# Altium schematic sheet DAC_Analog_Output.SchDoc
size A4
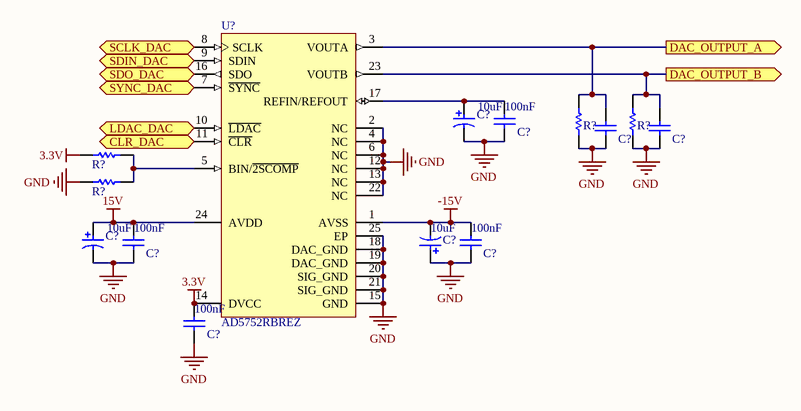
[diagram p0: DAC_Analog_Output.SchDoc]

## Parts
(Parts that share a designator on the sheet are numbered #1, #2 ... from top to bottom, then left to right.)
C?#1  Capacitance: 10uF  [KEMT-A-3216-18-2_M]  (hidden comment: T491A106K016AT)
C?#2  value 100nF  [CAPC0402(1005)60_L]  (hidden comment: CAP0402)
C?#3  CAP0402  [CAPC0402(1005)60_L]  (value not drawn)
C?#4  CAP0402  [CAPC0402(1005)60_L]  (value not drawn)
C?#5  Capacitance: 10uF  [KEMT-A-3216-18-2_M]  (hidden comment: T491A106K016AT)
C?#6  value 100nF  [CAPC0402(1005)60_L]  (hidden comment: CAP0402)
C?#7  value 100nF  [CAPC0402(1005)60_L]  (hidden comment: CAP0402)
C?#8  Capacitance: 10uF  [KEMT-A-3216-18-2_M]  (hidden comment: T491A106K016AT)
C?#9  value 100nF  [CAPC0402(1005)60_L]  (hidden comment: CAP0402)
R?#1  RES0402  [RESC0402(1005)_L]  (value not drawn)
R?#2  RES0402  [RESC0402(1005)_L]  (value not drawn)
R?#3  RES0402  [RESC0402(1005)_L]  (value not drawn)
R?#4  RES0402  [RESC0402(1005)_L]  (value not drawn)
U?  AD5752RBREZ  [RE-24_L]

## Ports
CLR_DAC (in), DAC_OUTPUT_A (out), DAC_OUTPUT_B (out), LDAC_DAC (in), SCLK_DAC (in), SDIN_DAC (in), SDO_DAC (out), SYNC_DAC (in)

## Nets
3.3V: C?#9.1 R?#3.2 U?.14(DVCC)
15V: C?#5.1 C?#6.1 U?.24(AVDD)
-15V: C?#7.1 C?#8.2 U?.1(AVSS)
GND: C?#1.2 C?#2.2 C?#3.2 C?#4.2 C?#5.2 C?#6.2 C?#7.2 C?#8.1 C?#9.2 R?#1.2 R?#2.2 R?#4.2 U?.2(NC) U?.4(NC) U?.6(NC) U?.12(NC) U?.13(NC) U?.15(GND) U?.18(DAC_GND) U?.19(DAC_GND) U?.20(SIG_GND) U?.21(SIG_GND) U?.22(NC) U?.25(EP)
CLR_DAC: U?.11(~{CLR}) ; port CLR_DAC
DAC_OUTPUT_A: C?#3.1 R?#1.1 U?.3(VOUTA) ; port DAC_OUTPUT_A
DAC_OUTPUT_B: C?#4.1 R?#2.1 U?.23(VOUTB) ; port DAC_OUTPUT_B
LDAC_DAC: U?.10(~{LDAC}) ; port LDAC_DAC
SCLK_DAC: U?.8(SCLK) ; port SCLK_DAC
SDIN_DAC: U?.9(SDIN) ; port SDIN_DAC
SDO_DAC: U?.16(SDO) ; port SDO_DAC
SYNC_DAC: U?.7(~{SYNC}) ; port SYNC_DAC
NetC?#1_1: C?#1.1 C?#2.1 U?.17(REFIN/REFOUT)
NetR?#3_1: R?#3.1 R?#4.1 U?.5(BIN/~{2SCOMP})

## Library data of the parts
C?#1 C?#5 C?#8 = CMP-2000-05173-1: Capacitor, Tantalum, 10 uF, +/- 10%, 16 V, -55 to 125 degC, 2-Pin SMD (1206), RoHS, Tape and Reel; Manufacturer: Kemet; Insulation: NotRequired; Voltage: 16VDC; Product Height (mm): 1.6mm; Polarity: Polar; Lead Spacing (nom): NotRequiredmm; Product Length (mm): 3.2mm; Case Style: Molded; DCL: 1.6uA; ESR: 7ohm; DF: 8%; Mounting Style: SurfaceMount; Manufacturer URL: http://www.kemet.com/; Datasheet Version: Apr-14; Package Description: 2-Pin Surface Mount Device, Body 3.2 x 1.6 mm; Operating Temp Range: -55Cto125C; Package Reference: 1206; Wire Form: NotRequired; Datasheet URL: http://www.farnell.com/datasheets/1824869.pdf; Tolerance (+ or -): 10%; Failure Rate: NotRequired; Length W/Weld: NotRequiredmm; Package / Case: 3216-18; Seated Plane Height: NotRequiredmm; Product Diameter (mm): NotRequiredmm; Construction: SMTChip; Seal: NotRequired; Case Code: A; Product Depth (mm): 1.6mm; Packaging: TapeandReel
C?#2 C?#6 C?#7 C?#9 = CMP-1590-00004-1: 0402 (1005 Metric) Chip Capacitor; Case-EIA: 0402; Case-Metric: 1005; PackageReference: CAPC0402(1005)60
C?#3 C?#4 = CMP-1590-00004-1: 0402 (1005 Metric) Chip Capacitor; Case-EIA: 0402; Value: 100nF; Case-Metric: 1005; PackageReference: CAPC0402(1005)60
R?#1-R?#4 = CMP-1591-00004-1: 0402 (1005 Metric) Chip Resistor; Case-EIA: 0402; Case-Metric: 1005; PackageReference: RESC0402(1005)
U? = CMP-0318-01754-2: Dual 16-Bit Voltage Output Digital-to-Analog Converter with Serial Interface, -40 to +85 degC, RE-24, Pb-Free, Tube; Manufacturer: Analog Devices; Max V+: 16.5V; Settling Time: 7.5Âµs; # DAC Outputs: 2; Single Supply: Yes; Op Pwr Diss: 190mW; Resolution (Bits): 16; PartNumber: AD5752RBREZ; ComponentLink1URL: http://www.analog.com/en/index.html; ComponentLink3URL: http://www.analog.com/static/imported-files/packages/PKG_PDF/TSSOP_EP(RE)/RE_24.pdf; Generic Part Number: AD5752R; RoHS: Y; ComponentLink5Description: Reference Design URL; ComponentLink3Description: Package Specification; DatasheetVersion: Rev.D; PackageReference: RE-24; ComponentLink2URL: http://www.analog.com/static/imported-files/data_sheets/AD5722R_5732R_5752R.pdf; ComponentLink4Description: Product URL; PackageDescription: 24-Lead Thin Shrink Small Outline Package, Exposed Pad [TSSOP_EP]; Packing: Tube; ComponentLink2Description: Datasheet; ComponentLink5URL: http://www.analog.com/en/digital-to-analog-converters/da-converters/ad5752r/products/product.html#prod_cross_sell; PackageVersion: 050806-A; Code_JEDEC: MO-153-ADT; ComponentLink1Description: Manufacturer URL; ComponentLink4URL: http://www.analog.com/en/digital-to-analog-converters/da-converters/ad5752r/products/product.html; RevisionNote: Component URL fixed; Mounting Technology: Surface Mount